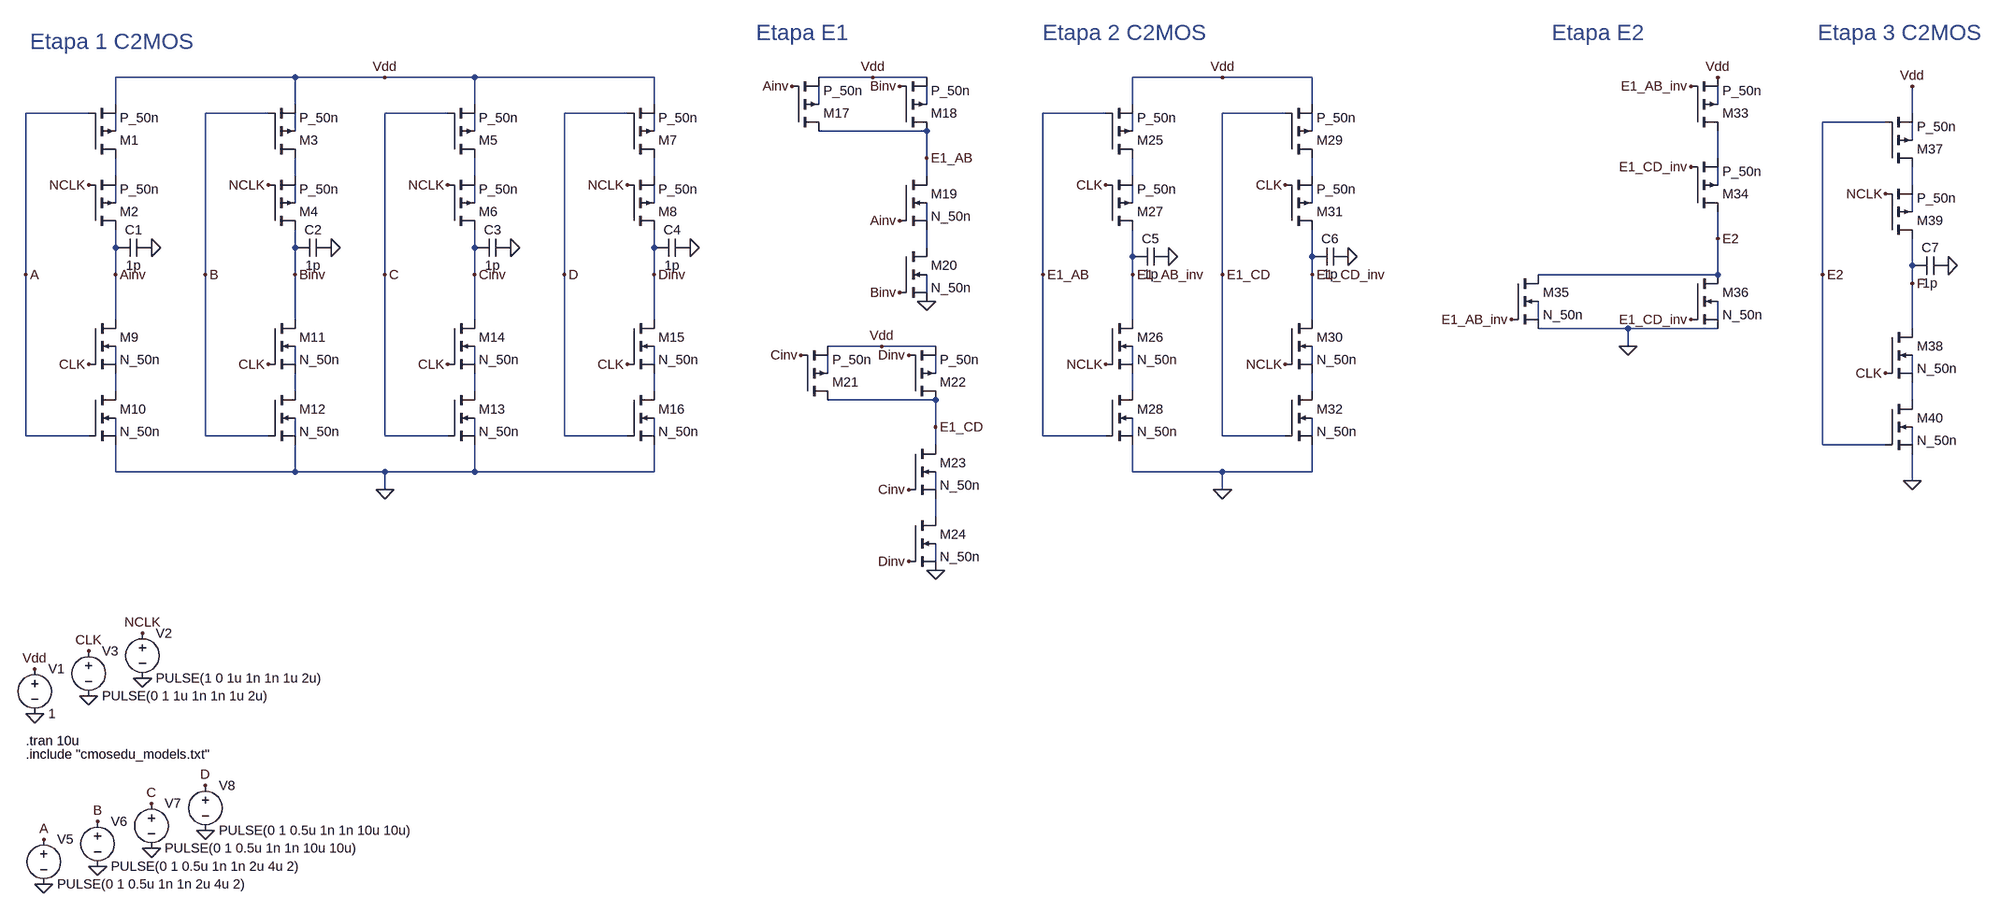
[diagram p0: schematic 2ValidacionDeFuncionamiento.asc]
2ValidacionDeFuncionamiento.asc, the LTspice schematic file:
Version 4
SHEET 1 3492 1252
WIRE -288 -224 -608 -224
WIRE -128 -224 -288 -224
WIRE 32 -224 -128 -224
WIRE 352 -224 32 -224
WIRE 880 -224 784 -224
WIRE 976 -224 880 -224
WIRE 1680 -224 1520 -224
WIRE 1840 -224 1680 -224
WIRE -608 -176 -608 -224
WIRE -288 -176 -288 -224
WIRE 32 -176 32 -224
WIRE 352 -176 352 -224
WIRE 784 -176 784 -208
WIRE 976 -176 976 -208
WIRE 1520 -176 1520 -224
WIRE 1840 -176 1840 -224
WIRE 2608 -176 2608 -208
WIRE -656 -160 -768 -160
WIRE -336 -160 -448 -160
WIRE -16 -160 -128 -160
WIRE 304 -160 192 -160
WIRE 1472 -160 1360 -160
WIRE 1792 -160 1680 -160
WIRE 3088 -160 3088 -208
WIRE 3040 -144 2928 -144
WIRE -608 -128 -608 -160
WIRE -288 -128 -288 -160
WIRE 32 -128 32 -160
WIRE 352 -128 352 -160
WIRE 976 -128 784 -128
WIRE 1520 -128 1520 -160
WIRE 1840 -128 1840 -160
WIRE 3088 -112 3088 -144
WIRE 976 -80 976 -128
WIRE 2608 -80 2608 -128
WIRE -608 -48 -608 -80
WIRE -288 -48 -288 -80
WIRE 32 -48 32 -80
WIRE 352 -48 352 -80
WIRE 976 -48 976 -80
WIRE 1520 -48 1520 -80
WIRE 1840 -48 1840 -80
WIRE 2608 -32 2608 -64
WIRE 3088 -32 3088 -64
WIRE -608 0 -608 -32
WIRE -288 0 -288 -32
WIRE 32 0 32 -32
WIRE 352 0 352 -32
WIRE 1520 0 1520 -32
WIRE 1840 0 1840 -32
WIRE 3088 16 3088 -16
WIRE 976 32 976 0
WIRE 2608 64 2608 16
WIRE -608 80 -608 48
WIRE -288 80 -288 48
WIRE 32 80 32 48
WIRE 352 80 352 48
WIRE 976 80 976 48
WIRE 1520 96 1520 48
WIRE 1840 96 1840 48
WIRE 3088 112 3088 64
WIRE -768 128 -768 -160
WIRE -608 128 -608 80
WIRE -448 128 -448 -160
WIRE -288 128 -288 80
WIRE -128 128 -128 -160
WIRE 32 128 32 80
WIRE 192 128 192 -160
WIRE 352 128 352 80
WIRE 1360 128 1360 -160
WIRE 1520 128 1520 96
WIRE 1680 128 1680 -160
WIRE 1840 128 1840 96
WIRE 2608 128 2608 64
WIRE 2608 128 2288 128
WIRE 2928 128 2928 -144
WIRE 3088 144 3088 112
WIRE 976 160 976 128
WIRE -608 208 -608 128
WIRE -288 208 -288 128
WIRE 32 208 32 128
WIRE 352 208 352 128
WIRE 1520 208 1520 128
WIRE 1840 208 1840 128
WIRE 2288 208 2288 176
WIRE 2608 208 2608 176
WIRE 2448 224 2288 224
WIRE 2608 224 2448 224
WIRE 3088 224 3088 144
WIRE 896 256 800 256
WIRE 992 256 896 256
WIRE 2448 256 2448 224
WIRE -608 288 -608 256
WIRE -288 288 -288 256
WIRE 32 288 32 256
WIRE 352 288 352 256
WIRE 1520 288 1520 256
WIRE 1840 288 1840 256
WIRE 800 304 800 272
WIRE 992 304 992 272
WIRE 3088 304 3088 272
WIRE -608 336 -608 304
WIRE -288 336 -288 304
WIRE 32 336 32 304
WIRE 352 336 352 304
WIRE 1520 336 1520 304
WIRE 1840 336 1840 304
WIRE 992 352 800 352
WIRE 3088 352 3088 320
WIRE 992 400 992 352
WIRE -768 416 -768 128
WIRE -656 416 -768 416
WIRE -608 416 -608 384
WIRE -448 416 -448 128
WIRE -336 416 -448 416
WIRE -288 416 -288 384
WIRE -128 416 -128 128
WIRE -16 416 -128 416
WIRE 32 416 32 384
WIRE 192 416 192 128
WIRE 304 416 192 416
WIRE 352 416 352 384
WIRE 1360 416 1360 128
WIRE 1472 416 1360 416
WIRE 1520 416 1520 384
WIRE 1680 416 1680 128
WIRE 1792 416 1680 416
WIRE 1840 416 1840 384
WIRE 992 432 992 400
WIRE 2928 432 2928 128
WIRE 3040 432 2928 432
WIRE 3088 432 3088 400
WIRE -608 480 -608 432
WIRE -288 480 -288 432
WIRE -288 480 -608 480
WIRE -128 480 -288 480
WIRE 32 480 32 432
WIRE 32 480 -128 480
WIRE 352 480 352 432
WIRE 352 480 32 480
WIRE 1520 480 1520 432
WIRE 1680 480 1520 480
WIRE 1840 480 1840 432
WIRE 1840 480 1680 480
WIRE 3088 496 3088 448
WIRE -128 512 -128 480
WIRE 992 512 992 480
WIRE 1680 512 1680 480
WIRE 992 560 992 528
WIRE 992 640 992 608
FLAG -656 288 CLK
FLAG -752 912 0
FLAG -656 880 0
FLAG -752 832 Vdd
FLAG -560 848 0
FLAG -656 800 CLK
FLAG -560 768 NCLK
FLAG -448 1120 0
FLAG -544 1152 0
FLAG -640 1184 0
FLAG -736 1216 0
FLAG -736 1136 A
FLAG -640 1104 B
FLAG -544 1072 C
FLAG -448 1040 D
FLAG -128 -224 Vdd
FLAG -768 128 A
FLAG -448 128 B
FLAG -128 128 C
FLAG 192 128 D
FLAG -608 128 Ainv
FLAG -288 128 Binv
FLAG 32 128 Cinv
FLAG 352 128 Dinv
FLAG -128 512 0
FLAG 976 176 0
FLAG 992 656 0
FLAG 1520 128 E1_AB_inv
FLAG 1584 96 0
FLAG 1840 128 E1_CD_inv
FLAG 1904 96 0
FLAG 880 -224 Vdd
FLAG 896 256 Vdd
FLAG 1680 -224 Vdd
FLAG 1680 512 0
FLAG 976 -80 E1_AB
FLAG 992 400 E1_CD
FLAG 1360 128 E1_AB
FLAG 1680 128 E1_CD
FLAG 2608 -224 Vdd
FLAG 2448 256 0
FLAG 2560 -208 E1_AB_inv
FLAG 2560 -64 E1_CD_inv
FLAG 2240 208 E1_AB_inv
FLAG 2560 208 E1_CD_inv
FLAG 2608 64 E2
FLAG 3040 304 CLK
FLAG 3040 -16 NCLK
FLAG 3088 144 F
FLAG 3152 112 0
FLAG 3088 -208 Vdd
FLAG 3088 496 0
FLAG 2928 128 E2
FLAG 1472 288 NCLK
FLAG 1472 -32 CLK
FLAG -336 -32 NCLK
FLAG -16 -32 NCLK
FLAG 304 -32 NCLK
FLAG -336 288 CLK
FLAG -16 288 CLK
FLAG 304 288 CLK
FLAG 1792 288 NCLK
FLAG 1792 -32 CLK
FLAG -656 -32 NCLK
FLAG 736 -208 Ainv
FLAG 928 -208 Binv
FLAG 752 272 Cinv
FLAG 944 272 Dinv
FLAG 928 32 Ainv
FLAG 928 160 Binv
FLAG 944 512 Cinv
FLAG 944 640 Dinv
FLAG -544 80 0
FLAG -224 80 0
FLAG 96 80 0
FLAG 416 80 0
SYMBOL voltage -752 816 R0
WINDOW 123 0 0 Left 0
WINDOW 39 0 0 Left 0
SYMATTR InstName V1
SYMATTR Value 1
SYMBOL voltage -656 784 R0
WINDOW 123 0 0 Left 0
WINDOW 39 0 0 Left 0
SYMATTR InstName V3
SYMATTR Value PULSE(0 1 1u 1n 1n 1u 2u)
SYMBOL voltage -736 1120 R0
WINDOW 123 0 0 Left 0
WINDOW 39 0 0 Left 0
SYMATTR InstName V5
SYMATTR Value PULSE(0 1 0.5u 1n 1n 2u 4u 2)
SYMBOL voltage -640 1088 R0
WINDOW 123 0 0 Left 0
WINDOW 39 0 0 Left 0
SYMATTR InstName V6
SYMATTR Value PULSE(0 1 0.5u 1n 1n 2u 4u 2)
SYMBOL voltage -544 1056 R0
WINDOW 123 0 0 Left 0
WINDOW 39 0 0 Left 0
SYMATTR InstName V7
SYMATTR Value PULSE(0 1 0.5u 1n 1n 10u 10u)
SYMBOL voltage -448 1024 R0
WINDOW 123 0 0 Left 0
WINDOW 39 0 0 Left 0
SYMATTR InstName V8
SYMATTR Value PULSE(0 1 0.5u 1n 1n 10u 10u)
SYMBOL cap 1584 80 R90
WINDOW 0 0 32 VBottom 2
WINDOW 3 32 32 VTop 2
SYMATTR InstName C5
SYMATTR Value 1p
SYMBOL cap 1904 80 R90
WINDOW 0 0 32 VBottom 2
WINDOW 3 32 32 VTop 2
SYMATTR InstName C6
SYMATTR Value 1p
SYMBOL cap 3152 96 R90
WINDOW 0 0 32 VBottom 2
WINDOW 3 32 32 VTop 2
SYMATTR InstName C7
SYMATTR Value 1p
SYMBOL voltage -560 752 R0
WINDOW 123 0 0 Left 0
WINDOW 39 0 0 Left 0
SYMATTR InstName V2
SYMATTR Value PULSE(1 0 1u 1n 1n 1u 2u)
SYMBOL pmos4 -656 -80 M180
SYMATTR InstName M1
SYMATTR Value P_50n
SYMATTR Value2 l=50n w=600n
SYMBOL pmos4 -656 48 M180
SYMATTR InstName M2
SYMATTR Value P_50n
SYMATTR Value2 l=50n w=600n
SYMBOL pmos4 -336 -80 M180
SYMATTR InstName M3
SYMATTR Value P_50n
SYMATTR Value2 l=50n w=600n
SYMBOL pmos4 -336 48 M180
SYMATTR InstName M4
SYMATTR Value P_50n
SYMATTR Value2 l=50n w=600n
SYMBOL pmos4 -16 -80 M180
SYMATTR InstName M5
SYMATTR Value P_50n
SYMATTR Value2 l=50n w=600n
SYMBOL pmos4 -16 48 M180
SYMATTR InstName M6
SYMATTR Value P_50n
SYMATTR Value2 l=50n w=600n
SYMBOL pmos4 304 -80 M180
SYMATTR InstName M7
SYMATTR Value P_50n
SYMATTR Value2 l=50n w=600n
SYMBOL pmos4 304 48 M180
SYMATTR InstName M8
SYMATTR Value P_50n
SYMATTR Value2 l=50n w=600n
SYMBOL nmos4 -656 208 R0
SYMATTR InstName M9
SYMATTR Value N_50n
SYMATTR Value2 l=50n w=400n
SYMBOL nmos4 -656 336 R0
SYMATTR InstName M10
SYMATTR Value N_50n
SYMATTR Value2 l=50n w=400n
SYMBOL nmos4 -336 208 R0
SYMATTR InstName M11
SYMATTR Value N_50n
SYMATTR Value2 l=50n w=400n
SYMBOL nmos4 -336 336 R0
SYMATTR InstName M12
SYMATTR Value N_50n
SYMATTR Value2 l=50n w=400n
SYMBOL nmos4 -16 336 R0
SYMATTR InstName M13
SYMATTR Value N_50n
SYMATTR Value2 l=50n w=400n
SYMBOL nmos4 -16 208 R0
SYMATTR InstName M14
SYMATTR Value N_50n
SYMATTR Value2 l=50n w=400n
SYMBOL nmos4 304 208 R0
SYMATTR InstName M15
SYMATTR Value N_50n
SYMATTR Value2 l=50n w=400n
SYMBOL nmos4 304 336 R0
SYMATTR InstName M16
SYMATTR Value N_50n
SYMATTR Value2 l=50n w=400n
SYMBOL cap -544 64 R90
WINDOW 0 0 32 VBottom 2
WINDOW 3 32 32 VTop 2
SYMATTR InstName C1
SYMATTR Value 1p
SYMBOL cap -224 64 R90
WINDOW 0 0 32 VBottom 2
WINDOW 3 32 32 VTop 2
SYMATTR InstName C2
SYMATTR Value 1p
SYMBOL cap 96 64 R90
WINDOW 0 0 32 VBottom 2
WINDOW 3 32 32 VTop 2
SYMATTR InstName C3
SYMATTR Value 1p
SYMBOL cap 416 64 R90
WINDOW 0 0 32 VBottom 2
WINDOW 3 32 32 VTop 2
SYMATTR InstName C4
SYMATTR Value 1p
SYMBOL pmos4 736 -128 M180
SYMATTR InstName M17
SYMATTR Value P_50n
SYMATTR Value2 l=50n w=600n
SYMBOL pmos4 928 -128 M180
SYMATTR InstName M18
SYMATTR Value P_50n
SYMATTR Value2 l=50n w=600n
SYMBOL nmos4 928 -48 R0
SYMATTR InstName M19
SYMATTR Value N_50n
SYMATTR Value2 l=50n w=400n
SYMBOL nmos4 928 80 R0
SYMATTR InstName M20
SYMATTR Value N_50n
SYMATTR Value2 l=50n w=400n
SYMBOL pmos4 752 352 M180
SYMATTR InstName M21
SYMATTR Value P_50n
SYMATTR Value2 l=50n w=600n
SYMBOL pmos4 944 352 M180
SYMATTR InstName M22
SYMATTR Value P_50n
SYMATTR Value2 l=50n w=600n
SYMBOL nmos4 944 432 R0
SYMATTR InstName M23
SYMATTR Value N_50n
SYMATTR Value2 l=50n w=400n
SYMBOL nmos4 944 560 R0
SYMATTR InstName M24
SYMATTR Value N_50n
SYMATTR Value2 l=50n w=400n
SYMBOL pmos4 1472 -80 M180
SYMATTR InstName M25
SYMATTR Value P_50n
SYMATTR Value2 l=50n w=600n
SYMBOL pmos4 1472 48 M180
SYMATTR InstName M27
SYMATTR Value P_50n
SYMATTR Value2 l=50n w=600n
SYMBOL pmos4 1792 -80 M180
SYMATTR InstName M29
SYMATTR Value P_50n
SYMATTR Value2 l=50n w=600n
SYMBOL pmos4 1792 48 M180
SYMATTR InstName M31
SYMATTR Value P_50n
SYMATTR Value2 l=50n w=600n
SYMBOL nmos4 1472 208 R0
SYMATTR InstName M26
SYMATTR Value N_50n
SYMATTR Value2 l=50n w=400n
SYMBOL nmos4 1472 336 R0
SYMATTR InstName M28
SYMATTR Value N_50n
SYMATTR Value2 l=50n w=400n
SYMBOL nmos4 1792 208 R0
SYMATTR InstName M30
SYMATTR Value N_50n
SYMATTR Value2 l=50n w=400n
SYMBOL nmos4 1792 336 R0
SYMATTR InstName M32
SYMATTR Value N_50n
SYMATTR Value2 l=50n w=400n
SYMBOL pmos4 2560 -128 M180
SYMATTR InstName M33
SYMATTR Value P_50n
SYMATTR Value2 l=50n w=600n
SYMBOL pmos4 2560 16 M180
SYMATTR InstName M34
SYMATTR Value P_50n
SYMATTR Value2 l=50n w=600n
SYMBOL nmos4 2240 128 R0
SYMATTR InstName M35
SYMATTR Value N_50n
SYMATTR Value2 l=50n w=400n
SYMBOL nmos4 2560 128 R0
SYMATTR InstName M36
SYMATTR Value N_50n
SYMATTR Value2 l=50n w=400n
SYMBOL pmos4 3040 -64 M180
SYMATTR InstName M37
SYMATTR Value P_50n
SYMATTR Value2 l=50n w=600n
SYMBOL pmos4 3040 64 M180
SYMATTR InstName M39
SYMATTR Value P_50n
SYMATTR Value2 l=50n w=600n
SYMBOL nmos4 3040 224 R0
SYMATTR InstName M38
SYMATTR Value N_50n
SYMATTR Value2 l=50n w=400n
SYMBOL nmos4 3040 352 R0
SYMATTR InstName M40
SYMATTR Value N_50n
SYMATTR Value2 l=50n w=400n
TEXT -768 960 Left 2 !.tran 10u
TEXT -768 984 Left 2 !.include "cmosedu_models.txt"
TEXT -760 -288 Left 4 ;Etapa 1 C2MOS
TEXT 672 -304 Left 4 ;Etapa E1
TEXT 1360 -304 Left 4 ;Etapa 2 C2MOS
TEXT 2312 -304 Left 4 ;Etapa E2
TEXT 2920 -304 Left 4 ;Etapa 3 C2MOS

The netlist it stands for:
* 2ValidacionDeFuncionamiento.asc
V1 Vdd 0 1
V3 CLK 0 PULSE(0 1 1u 1n 1n 1u 2u)
V5 A 0 PULSE(0 1 0.5u 1n 1n 2u 4u 2)
V6 B 0 PULSE(0 1 0.5u 1n 1n 2u 4u 2)
V7 C 0 PULSE(0 1 0.5u 1n 1n 10u 10u)
V8 D 0 PULSE(0 1 0.5u 1n 1n 10u 10u)
C5 0 E1_AB_inv 1p
C6 0 E1_CD_inv 1p
C7 0 F 1p
V2 NCLK 0 PULSE(1 0 1u 1n 1n 1u 2u)
M1 N012 A Vdd N004 P_50n l=50n w=600n
M2 Ainv NCLK N012 N020 P_50n l=50n w=600n
M3 N013 B Vdd N005 P_50n l=50n w=600n
M4 Binv NCLK N013 N021 P_50n l=50n w=600n
M5 N014 C Vdd N006 P_50n l=50n w=600n
M6 Cinv NCLK N014 N022 P_50n l=50n w=600n
M7 N015 D Vdd N007 P_50n l=50n w=600n
M8 Dinv NCLK N015 N023 P_50n l=50n w=600n
M9 Ainv CLK N041 N032 N_50n l=50n w=400n
M10 N041 A 0 N048 N_50n l=50n w=400n
M11 Binv CLK N042 N033 N_50n l=50n w=400n
M12 N042 B 0 N049 N_50n l=50n w=400n
M13 N043 C 0 N050 N_50n l=50n w=400n
M14 Cinv CLK N043 N034 N_50n l=50n w=400n
M15 Dinv CLK N044 N035 N_50n l=50n w=400n
M16 N044 D 0 N051 N_50n l=50n w=400n
C1 0 Ainv 1p
C2 0 Binv 1p
C3 0 Cinv 1p
C4 0 Dinv 1p
M17 E1_AB Ainv Vdd N001 P_50n l=50n w=600n
M18 E1_AB Binv Vdd N002 P_50n l=50n w=600n
M19 E1_AB Ainv N028 N027 N_50n l=50n w=400n
M20 N028 Binv 0 N029 N_50n l=50n w=400n
M21 E1_CD Cinv Vdd N038 P_50n l=50n w=600n
M22 E1_CD Dinv Vdd N039 P_50n l=50n w=600n
M23 E1_CD Cinv N056 N055 N_50n l=50n w=400n
M24 N056 Dinv 0 N057 N_50n l=50n w=400n
M25 N016 E1_AB Vdd N008 P_50n l=50n w=600n
M27 E1_AB_inv CLK N016 N024 P_50n l=50n w=600n
M29 N017 E1_CD Vdd N009 P_50n l=50n w=600n
M31 E1_CD_inv CLK N017 N025 P_50n l=50n w=600n
M26 E1_AB_inv NCLK N045 N036 N_50n l=50n w=400n
M28 N045 E1_AB 0 N052 N_50n l=50n w=400n
M30 E1_CD_inv NCLK N046 N037 N_50n l=50n w=400n
M32 N046 E1_CD 0 N053 N_50n l=50n w=400n
M33 N011 E1_AB_inv Vdd N003 P_50n l=50n w=600n
M34 E2 E1_CD_inv N011 N018 P_50n l=50n w=600n
M35 E2 E1_AB_inv 0 N030 N_50n l=50n w=400n
M36 E2 E1_CD_inv 0 N031 N_50n l=50n w=400n
M37 N019 E2 Vdd N010 P_50n l=50n w=600n
M39 F NCLK N019 N026 P_50n l=50n w=600n
M38 F CLK N047 N040 N_50n l=50n w=400n
M40 N047 E2 0 N054 N_50n l=50n w=400n
.model NMOS NMOS
.model PMOS PMOS
.lib standard.mos
.tran 10u
.include "cmosedu_models.txt"
* Etapa 1 C2MOS
* Etapa E1
* Etapa 2 C2MOS
* Etapa E2
* Etapa 3 C2MOS
.backanno
.end